# Altium project COMMS_ECU_revA.PrjPcb (part 1 of 3)
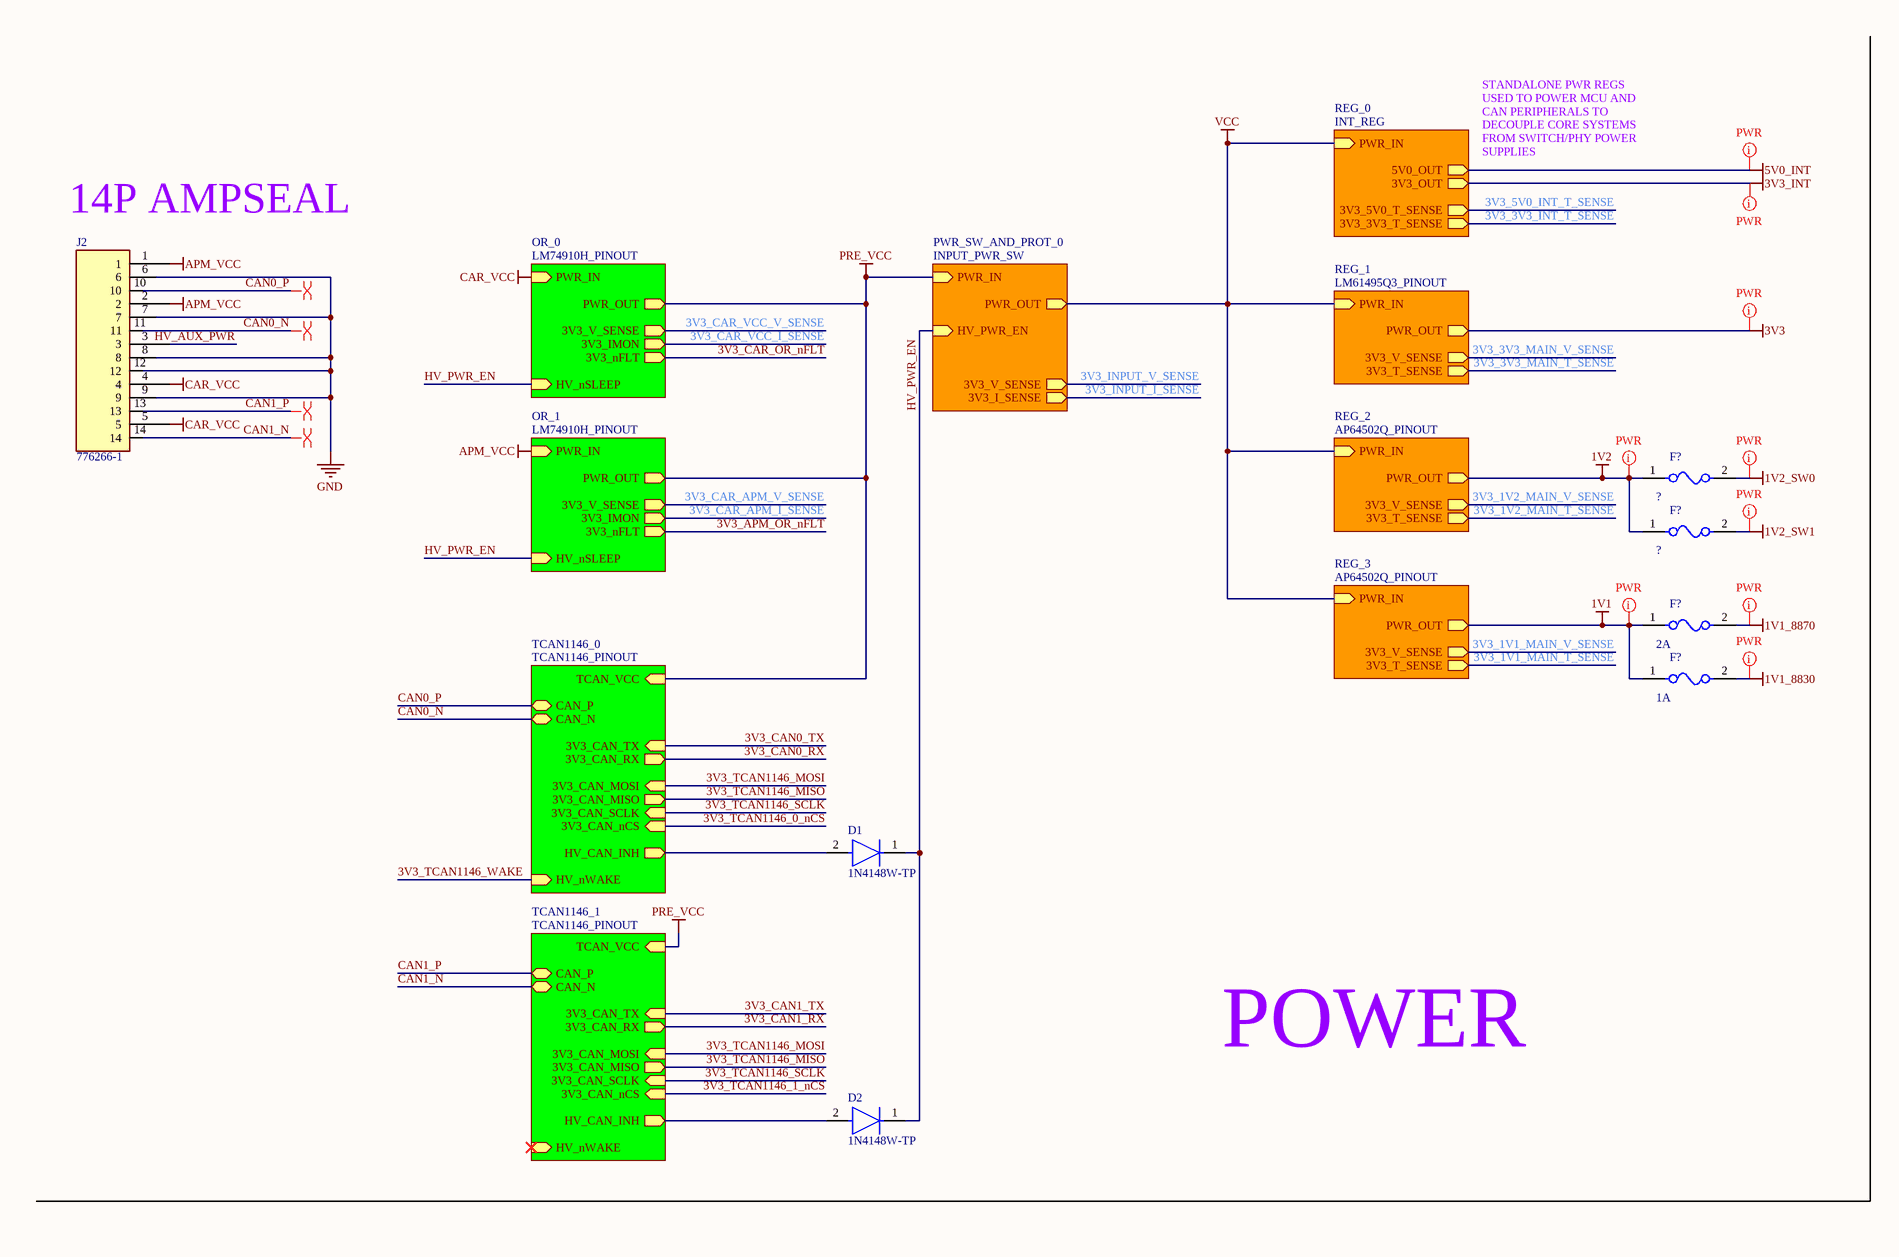
[diagram p0: COMMS_ECU_revA.SchDoc, top left]
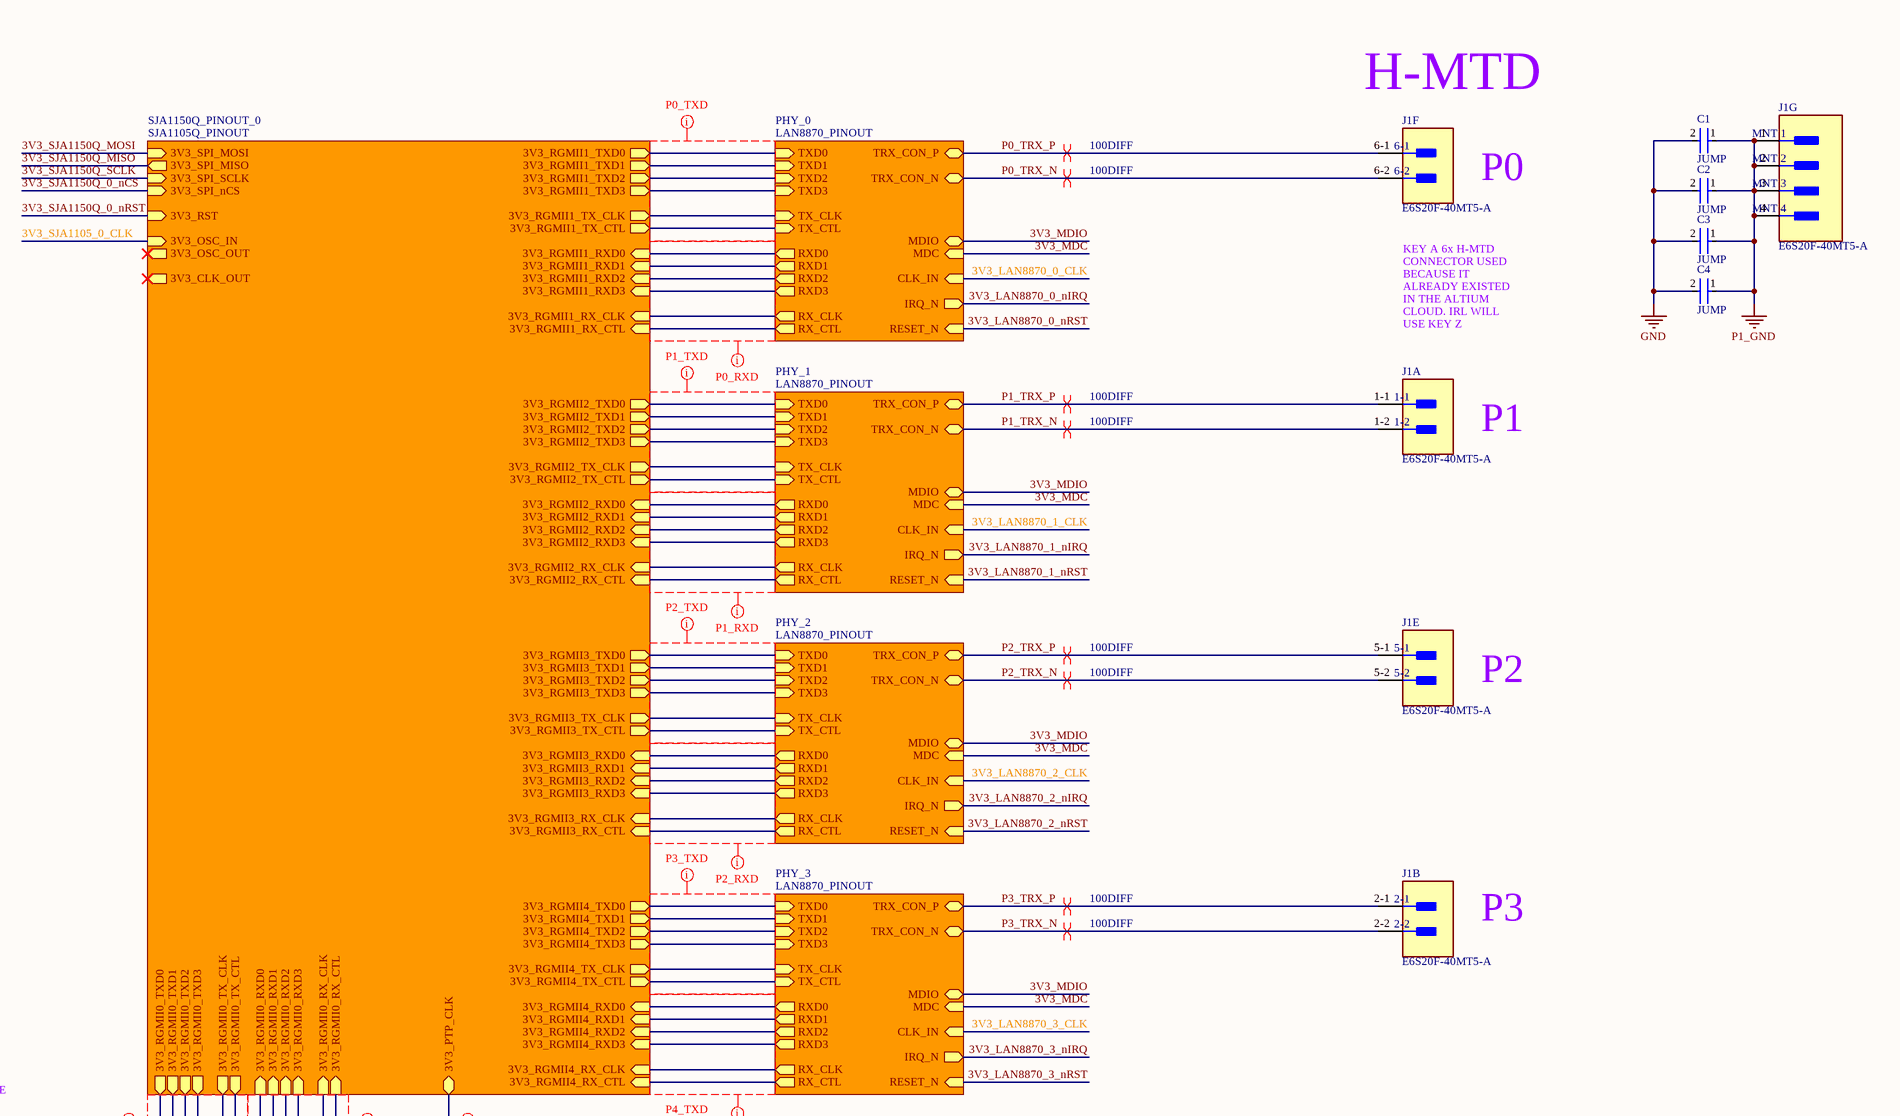
[diagram p1: COMMS_ECU_revA.SchDoc, top right]
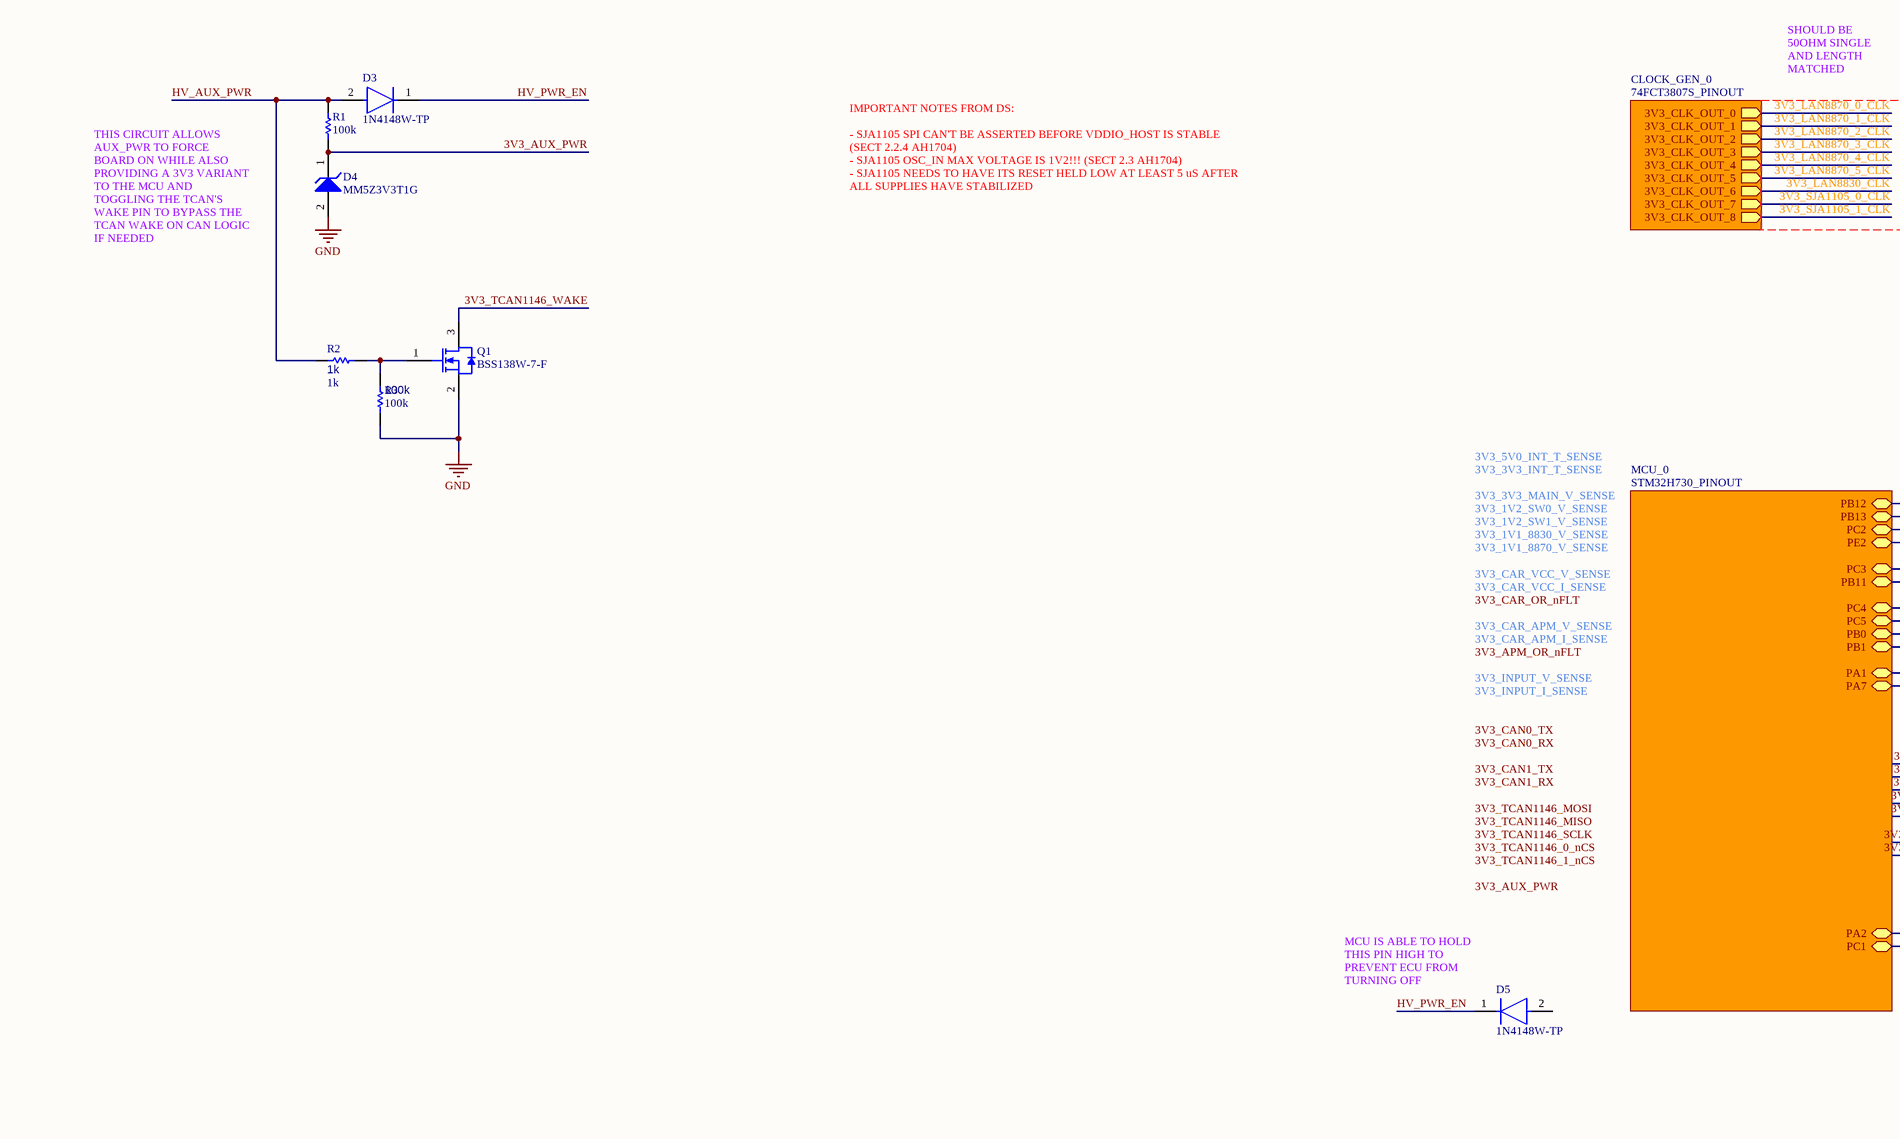
[diagram p2: COMMS_ECU_revA.SchDoc, bottom left]
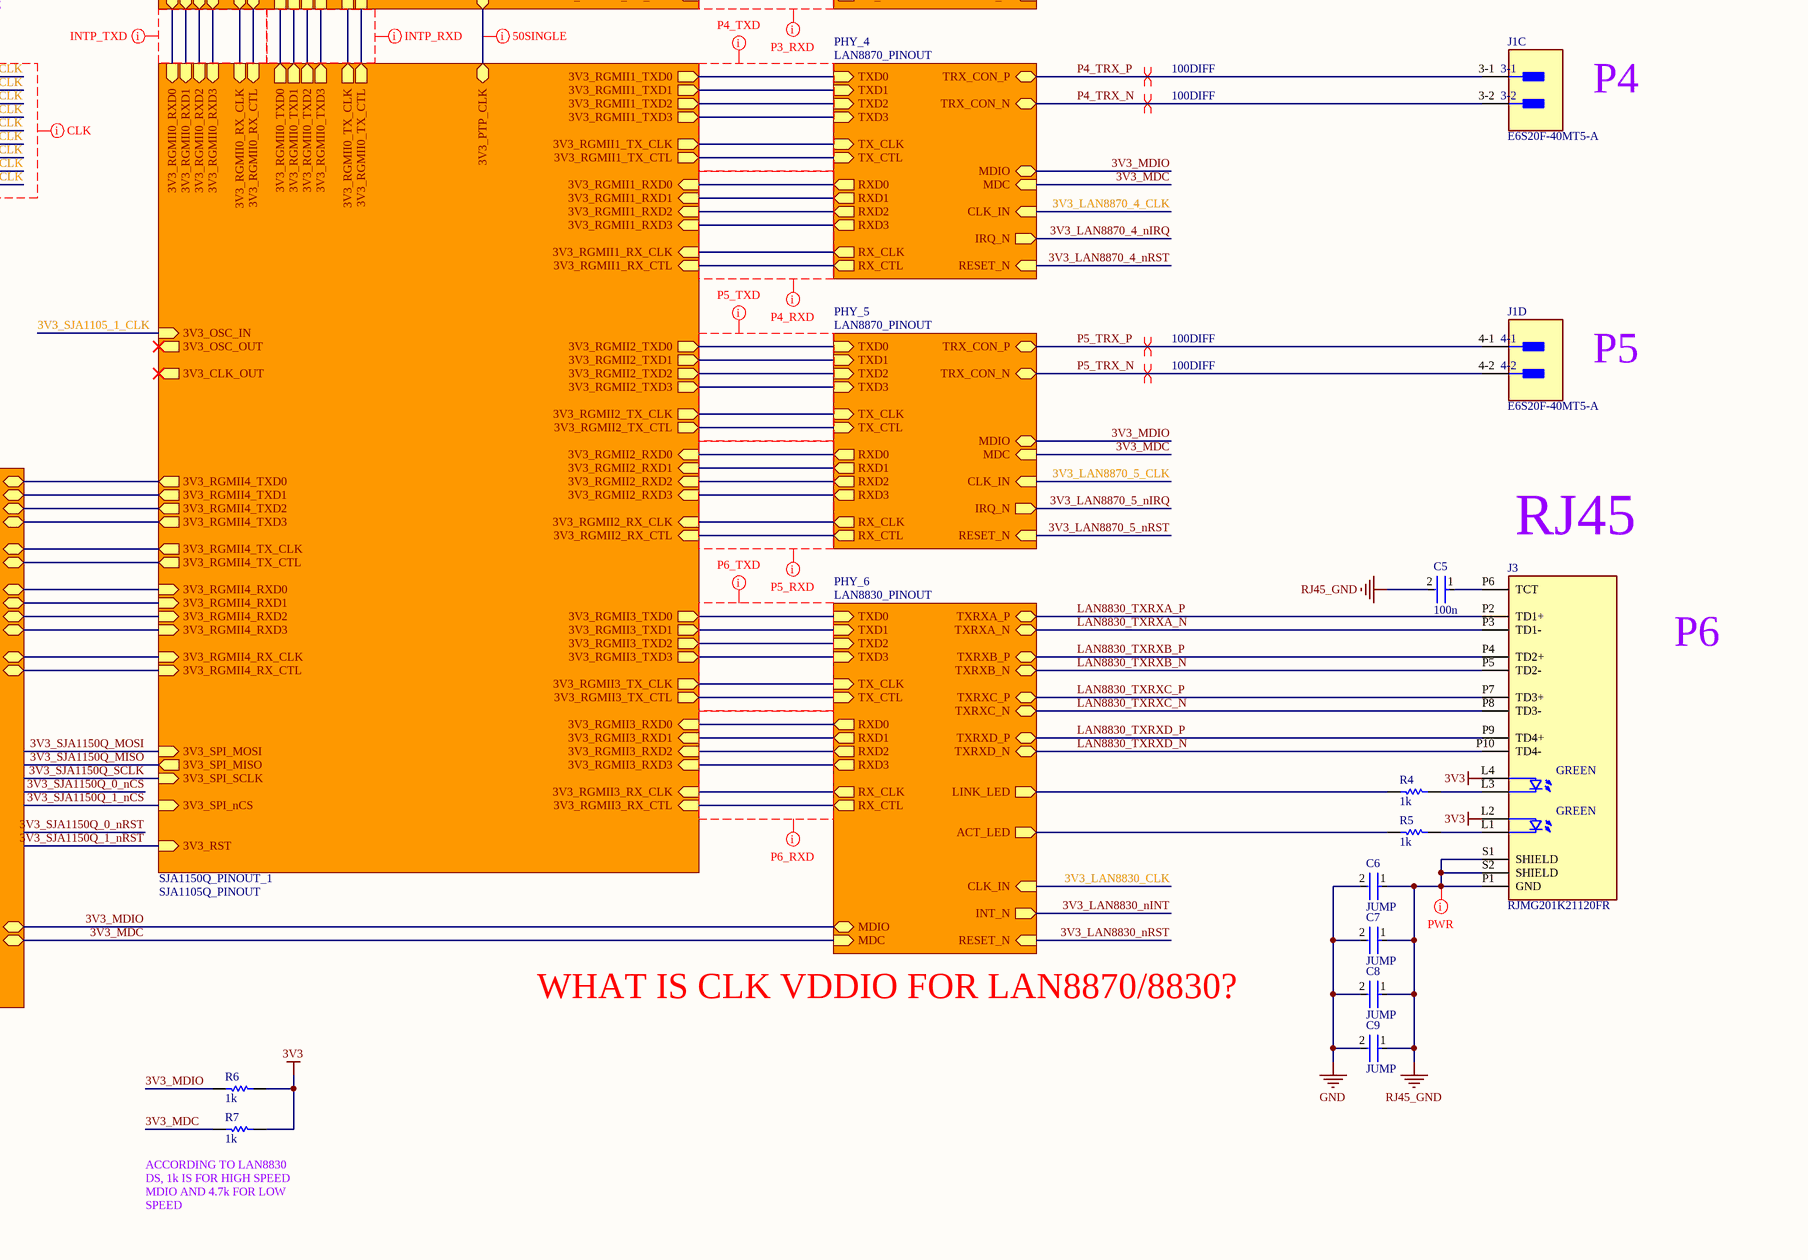
[diagram p3: COMMS_ECU_revA.SchDoc, bottom right]
13 sheets, 739 parts. Net scope: hierarchical (ports join the sheet entries above them; power ports are global).
Board file: COMMS_ECU_revA.PcbDoc
Sheets:
  COMMS_ECU_revA.SchDoc
    PHY_6 = LAN8830_PINOUT.SchDoc
    SJA1150Q_PINOUT_0 = SJA1105Q_PINOUT.SchDoc
    SJA1150Q_PINOUT_1 = SJA1105Q_PINOUT.SchDoc
    PHY_0 = LAN8870_PINOUT.SchDoc
    PHY_5 = LAN8870_PINOUT.SchDoc
    PHY_1 = LAN8870_PINOUT.SchDoc
    PHY_2 = LAN8870_PINOUT.SchDoc
    PHY_3 = LAN8870_PINOUT.SchDoc
    PHY_4 = LAN8870_PINOUT.SchDoc
    CLOCK_GEN_0 = 74FCT3807S_PINOUT.SchDoc
    MCU_0 = STM32H730_PINOUT.SchDoc
    TCAN1146_0 = TCAN1146_PINOUT.SchDoc
    OR_0 = LM74910H_PINOUT.SchDoc
    OR_1 = LM74910H_PINOUT.SchDoc
    PWR_SW_AND_PROT_0 = INPUT_PWR_SW.SchDoc
    REG_1 = LM61495Q3_PINOUT.SchDoc
    TCAN1146_1 = TCAN1146_PINOUT.SchDoc
    REG_3 = AP64502Q_PINOUT.SchDoc
    REG_0 = INT_REG.SchDoc
    REG_2 = AP64502Q_PINOUT.SchDoc
  MCP1726_PINOUT.SchDoc

## Sheet COMMS_ECU_revA.SchDoc
size D; SheetNumber: 1; SheetTotal: 13

### Parts
(Parts that share a designator on the sheet are numbered #1, #2 ... from top to bottom, then left to right.)
C1  JUMP  [FP-0402-L_1_0_0_05-W_0_5-IPC_A]
C2  JUMP  [FP-0402-L_1_0_0_05-W_0_5-IPC_A]
C3  JUMP  [FP-0402-L_1_0_0_05-W_0_5-IPC_A]
C4  JUMP  [FP-0402-L_1_0_0_05-W_0_5-IPC_A]
C5  100n  [FP-0402-L_1_0_0_05-W_0_5-IPC_A]
C6  JUMP  [FP-0402-L_1_0_0_05-W_0_5-IPC_A]
C7  JUMP  [FP-0402-L_1_0_0_05-W_0_5-IPC_A]
C8  JUMP  [FP-0402-L_1_0_0_05-W_0_5-IPC_A]
C9  JUMP  [FP-0402-L_1_0_0_05-W_0_5-IPC_A]
D1  1N4148W-TP  [FP-SOD-123-IPC_A]
D2  1N4148W-TP  [FP-SOD-123-IPC_A]
D3  1N4148W-TP  [FP-SOD-123-IPC_A]
D4  MM5Z3V3T1G  [ONSC-SOD-523-2-502-01_V]
D5  1N4148W-TP  [FP-SOD-123-IPC_A]
F?#1  ?  [FP-SF-1206FP-MFG]
F?#2  ?  [FP-SF-1206FP-MFG]
F?#3  2A  [FP-SF-1206FP-MFG]
F?#4  1A  [FP-SF-1206FP-MFG]
J1  E6S20F-40MT5-A  [FP-E6S20F-40MT5-A-MFG]  (parts A,B,C,D,E,F,G of 7)
J2  776266-1  [776266-1-Footprint-1]
J3  RJMG201K21120FR  [RJMG201K21120FR-Footprint-1]
Q1  BSS138W-7-F  [DIOD-SOT323-3_V]
R1  100k  [R0603B]
R2  1k  [R0603B]
R3  100k  [R0603B]
R4  1k  [R0603B]
R5  1k  [R0603B]
R6  1k  [R0603B]
R7  1k  [R0603B]

### Sub-sheets
CLOCK_GEN_0 = 74FCT3807S_PINOUT: 3V3_CLK_OUT_0 (out), 3V3_CLK_OUT_1 (out), 3V3_CLK_OUT_2 (out), 3V3_CLK_OUT_3 (out), 3V3_CLK_OUT_4 (out), 3V3_CLK_OUT_5 (out), 3V3_CLK_OUT_6 (out), 3V3_CLK_OUT_7 (out), 3V3_CLK_OUT_8 (out)
MCU_0 = STM32H730_PINOUT: PA1 (bidir), PA7 (bidir), PB0 (bidir), PB1 (bidir), PC4 (bidir), PB11 (bidir), PB12 (bidir), PB13 (bidir), PC2 (bidir), PC3 (bidir), PE2 (bidir), PC5 (bidir), PA2 (bidir), PC1 (bidir)
OR_0 = LM74910H_PINOUT: PWR_IN (in), PWR_OUT (out), 3V3_nFLT (out), HV_nSLEEP (in), 3V3_IMON (out), 3V3_V_SENSE (out)
OR_1 = LM74910H_PINOUT: PWR_IN (in), PWR_OUT (out), 3V3_nFLT (out), HV_nSLEEP (in), 3V3_IMON (out), 3V3_V_SENSE (out)
PHY_0 = LAN8870_PINOUT: TRX_CON_P (bidir), TRX_CON_N (bidir), RESET_N (in), TXD0 (in), TXD1 (in), TXD2 (in), TXD3 (in), TX_CTL (in), RXD0 (out), RXD1 (out), RXD2 (out), RXD3 (out), RX_CTL (out), TX_CLK (in), RX_CLK (out), MDIO (bidir), MDC (in), IRQ_N (out), CLK_IN (in)
PHY_1 = LAN8870_PINOUT: TRX_CON_P (bidir), TRX_CON_N (bidir), RESET_N (in), TXD0 (in), TXD1 (in), TXD2 (in), TXD3 (in), TX_CTL (in), RXD0 (out), RXD1 (out), RXD2 (out), RXD3 (out), RX_CTL (out), TX_CLK (in), RX_CLK (out), MDIO (bidir), MDC (in), IRQ_N (out), CLK_IN (in)
PHY_2 = LAN8870_PINOUT: TRX_CON_P (bidir), TRX_CON_N (bidir), RESET_N (in), TXD0 (in), TXD1 (in), TXD2 (in), TXD3 (in), TX_CTL (in), RXD0 (out), RXD1 (out), RXD2 (out), RXD3 (out), RX_CTL (out), TX_CLK (in), RX_CLK (out), MDIO (bidir), MDC (in), IRQ_N (out), CLK_IN (in)
PHY_3 = LAN8870_PINOUT: TRX_CON_P (bidir), TRX_CON_N (bidir), RESET_N (in), TXD0 (in), TXD1 (in), TXD2 (in), TXD3 (in), TX_CTL (in), RXD0 (out), RXD1 (out), RXD2 (out), RXD3 (out), RX_CTL (out), TX_CLK (in), RX_CLK (out), MDIO (bidir), MDC (in), IRQ_N (out), CLK_IN (in)
PHY_4 = LAN8870_PINOUT: TRX_CON_P (bidir), TRX_CON_N (bidir), RESET_N (in), TXD0 (in), TXD1 (in), TXD2 (in), TXD3 (in), TX_CTL (in), RXD0 (out), RXD1 (out), RXD2 (out), RXD3 (out), RX_CTL (out), TX_CLK (in), RX_CLK (out), MDIO (bidir), MDC (in), IRQ_N (out), CLK_IN (in)
PHY_5 = LAN8870_PINOUT: TRX_CON_P (bidir), TRX_CON_N (bidir), RESET_N (in), TXD0 (in), TXD1 (in), TXD2 (in), TXD3 (in), TX_CTL (in), RXD0 (out), RXD1 (out), RXD2 (out), RXD3 (out), RX_CTL (out), TX_CLK (in), RX_CLK (out), MDIO (bidir), MDC (in), IRQ_N (out), CLK_IN (in)
PHY_6 = LAN8830_PINOUT: TXD0 (in), TXD1 (in), TXD2 (in), TXD3 (in), TX_CTL (in), RXD0 (out), RXD1 (out), RXD2 (out), RXD3 (out), RX_CTL (out), TXRXA_P (bidir), TXRXA_N (bidir), ACT_LED (out), LINK_LED (out), RESET_N (in), TXRXB_P (bidir), TXRXB_N (bidir), TXRXC_P (bidir), TXRXC_N (bidir), TXRXD_P (bidir), TXRXD_N (bidir), TX_CLK (in), RX_CLK (out), MDIO (bidir), MDC (in), INT_N (out), CLK_IN (in)
PWR_SW_AND_PROT_0 = INPUT_PWR_SW: PWR_IN (in), PWR_OUT (out), HV_PWR_EN (in), 3V3_I_SENSE (out), 3V3_V_SENSE (out)
REG_0 = INT_REG: PWR_IN (in), 5V0_OUT (out), 3V3_OUT (out), 3V3_5V0_T_SENSE (out), 3V3_3V3_T_SENSE (out)
REG_1 = LM61495Q3_PINOUT: PWR_IN (in), PWR_OUT (out), 3V3_V_SENSE (out), 3V3_T_SENSE (out)
REG_2 = AP64502Q_PINOUT: PWR_OUT (out), PWR_IN (in), 3V3_V_SENSE (out), 3V3_T_SENSE (out)
REG_3 = AP64502Q_PINOUT: PWR_OUT (out), PWR_IN (in), 3V3_V_SENSE (out), 3V3_T_SENSE (out)
SJA1150Q_PINOUT_0 = SJA1105Q_PINOUT: 3V3_RGMII1_TXD0 (out), 3V3_RGMII1_TXD1 (out), 3V3_RGMII1_TXD2 (out), 3V3_RGMII1_TXD3 (out), 3V3_RGMII1_TX_CLK (out), 3V3_RGMII1_TX_CTL (out), 3V3_RGMII1_RXD0 (in), 3V3_RGMII1_RXD1 (in), 3V3_RGMII1_RXD2 (in), 3V3_RGMII1_RXD3 (in), 3V3_RGMII1_RX_CLK (in), 3V3_RGMII1_RX_CTL (in), 3V3_RGMII2_TXD0 (out), 3V3_RGMII2_TXD1 (out), 3V3_RGMII2_TXD2 (out), 3V3_RGMII2_TXD3 (out), 3V3_RGMII2_TX_CLK (out), 3V3_RGMII2_TX_CTL (out), 3V3_RGMII2_RXD0 (in), 3V3_RGMII2_RXD1 (in), 3V3_RGMII2_RXD2 (in), 3V3_RGMII2_RXD3 (in), 3V3_RGMII2_RX_CLK (in), 3V3_RGMII2_RX_CTL (in), 3V3_RGMII3_TXD0 (out), 3V3_RGMII3_TXD1 (out), 3V3_RGMII3_TXD2 (out), 3V3_RGMII3_TXD3 (out), 3V3_RGMII3_TX_CLK (out), 3V3_RGMII3_TX_CTL (out), 3V3_RGMII3_RXD0 (in), 3V3_RGMII3_RXD1 (in), 3V3_RGMII3_RXD2 (in), 3V3_RGMII3_RXD3 (in), 3V3_RGMII3_RX_CLK (in), 3V3_RGMII3_RX_CTL (in), 3V3_RGMII4_TXD0 (out), 3V3_RGMII4_TXD1 (out), 3V3_RGMII4_TXD2 (out), 3V3_RGMII4_TXD3 (out), 3V3_RGMII4_TX_CLK (out), 3V3_RGMII4_TX_CTL (out), 3V3_RGMII4_RXD0 (in), 3V3_RGMII4_RXD1 (in), 3V3_RGMII4_RXD2 (in), 3V3_RGMII4_RXD3 (in), 3V3_RGMII4_RX_CLK (in), 3V3_RGMII4_RX_CTL (in), 3V3_CLK_OUT (out), 3V3_RGMII0_TXD0 (out), 3V3_RGMII0_TXD1 (out), 3V3_RGMII0_TXD2 (out), 3V3_RGMII0_TXD3 (out), 3V3_RGMII0_TX_CLK (out), 3V3_RGMII0_TX_CTL (out), 3V3_RGMII0_RXD0 (in), 3V3_RGMII0_RXD1 (in), 3V3_RGMII0_RXD2 (in), 3V3_RGMII0_RXD3 (in), 3V3_RGMII0_RX_CLK (in), 3V3_RGMII0_RX_CTL (in), 3V3_PTP_CLK (bidir), 3V3_RST (in), 3V3_SPI_MOSI (in), 3V3_SPI_MISO (out), 3V3_SPI_SCLK (in), 3V3_SPI_nCS (in), 3V3_OSC_OUT (out), 3V3_OSC_IN (in)
SJA1150Q_PINOUT_1 = SJA1105Q_PINOUT: 3V3_RGMII1_TXD0 (out), 3V3_RGMII1_TXD1 (out), 3V3_RGMII1_TXD2 (out), 3V3_RGMII1_TXD3 (out), 3V3_RGMII1_TX_CLK (out), 3V3_RGMII1_TX_CTL (out), 3V3_RGMII1_RXD0 (in), 3V3_RGMII1_RXD1 (in), 3V3_RGMII1_RXD2 (in), 3V3_RGMII1_RXD3 (in), 3V3_RGMII1_RX_CLK (in), 3V3_RGMII1_RX_CTL (in), 3V3_RGMII2_TXD0 (out), 3V3_RGMII2_TXD1 (out), 3V3_RGMII2_TXD2 (out), 3V3_RGMII2_TXD3 (out), 3V3_RGMII2_TX_CLK (out), 3V3_RGMII2_TX_CTL (out), 3V3_RGMII2_RXD0 (in), 3V3_RGMII2_RXD1 (in), 3V3_RGMII2_RXD2 (in), 3V3_RGMII2_RXD3 (in), 3V3_RGMII2_RX_CLK (in), 3V3_RGMII2_RX_CTL (in), 3V3_RGMII3_TXD0 (out), 3V3_RGMII3_TXD1 (out), 3V3_RGMII3_TXD2 (out), 3V3_RGMII3_TXD3 (out), 3V3_RGMII3_TX_CLK (out), 3V3_RGMII3_TX_CTL (out), 3V3_RGMII3_RXD0 (in), 3V3_RGMII3_RXD1 (in), 3V3_RGMII3_RXD2 (in), 3V3_RGMII3_RXD3 (in), 3V3_RGMII3_RX_CLK (in), 3V3_RGMII3_RX_CTL (in), 3V3_RGMII4_TXD0 (out), 3V3_RGMII4_TXD1 (out), 3V3_RGMII4_TXD2 (out), 3V3_RGMII4_TXD3 (out), 3V3_RGMII4_TX_CLK (out), 3V3_RGMII4_TX_CTL (out), 3V3_RGMII4_RXD0 (in), 3V3_RGMII4_RXD1 (in), 3V3_RGMII4_RXD2 (in), 3V3_RGMII4_RXD3 (in), 3V3_RGMII4_RX_CLK (in), 3V3_RGMII4_RX_CTL (in), 3V3_RST (in), 3V3_SPI_MOSI (in), 3V3_SPI_MISO (out), 3V3_SPI_SCLK (in), 3V3_SPI_nCS (in), 3V3_RGMII0_RXD0 (in), 3V3_RGMII0_RXD1 (in), 3V3_RGMII0_RXD2 (in), 3V3_RGMII0_RXD3 (in), 3V3_RGMII0_TXD0 (out), 3V3_RGMII0_TXD1 (out), 3V3_RGMII0_TXD2 (out), 3V3_RGMII0_TXD3 (out), 3V3_RGMII0_RX_CLK (in), 3V3_RGMII0_RX_CTL (in), 3V3_RGMII0_TX_CLK (out), 3V3_RGMII0_TX_CTL (out), 3V3_CLK_OUT (out), 3V3_PTP_CLK (bidir), 3V3_OSC_OUT (out), 3V3_OSC_IN (in)
TCAN1146_0 = TCAN1146_PINOUT: CAN_P (bidir), CAN_N (bidir), HV_CAN_INH (out), TCAN_VCC (in), 3V3_CAN_TX (in), 3V3_CAN_RX (out), 3V3_CAN_MOSI (in), 3V3_CAN_MISO (out), 3V3_CAN_SCLK (in), 3V3_CAN_nCS (in), HV_nWAKE (in)
TCAN1146_1 = TCAN1146_PINOUT: CAN_P (bidir), CAN_N (bidir), HV_CAN_INH (out), TCAN_VCC (in), 3V3_CAN_TX (in), 3V3_CAN_RX (out), 3V3_CAN_MOSI (in), 3V3_CAN_MISO (out), 3V3_CAN_SCLK (in), 3V3_CAN_nCS (in), HV_nWAKE (in)

### Nets
1V1: F?#3.1 F?#4.1 ; sheet REG_3/PWR_OUT
1V1_8830: F?#4.2
1V1_8870: F?#3.2
1V2: F?#1.1 F?#2.1 ; sheet REG_2/PWR_OUT
1V2_SW0: F?#1.2
1V2_SW1: F?#2.2
3V3: J3.L2 J3.L4 R6.2 R7.2 ; sheet REG_1/PWR_OUT
APM_VCC: J2.1 J2.2 ; sheet OR_1/PWR_IN
CAR_VCC: J2.4 J2.5 ; sheet OR_0/PWR_IN
GND: C1.2 C2.2 C3.2 C4.2 C6.2 C7.2 C8.2 C9.2 D4.2(A) J2.6 J2.7 J2.8 J2.9 J2.12 Q1.2(S) R3.1
P1_GND: C1.1 C2.1 C3.1 C4.1 J1.1(MNT_1) J1.2(MNT_2) J1.3(MNT_3) J1.4(MNT_4)
PRE_VCC: sheet TCAN1146_0/TCAN_VCC, sheet OR_0/PWR_OUT, sheet OR_1/PWR_OUT, sheet PWR_SW_AND_PROT_0/PWR_IN, sheet TCAN1146_1/TCAN_VCC
RJ45_GND: C5.2 C6.1 C7.1 C8.1 C9.1 J3.P1(GND) J3.S1(SHIELD) J3.S2(SHIELD)
VCC: sheet PWR_SW_AND_PROT_0/PWR_OUT, sheet REG_1/PWR_IN, sheet REG_3/PWR_IN, sheet REG_0/PWR_IN, sheet REG_2/PWR_IN
3V3_1V1_MAIN_T_SENSE: sheet REG_3/3V3_T_SENSE
3V3_1V2_MAIN_T_SENSE: sheet REG_2/3V3_T_SENSE
3V3_3V3_INT_T_SENSE: sheet REG_0/3V3_3V3_T_SENSE
3V3_3V3_MAIN_T_SENSE: sheet REG_1/3V3_T_SENSE
3V3_5V0_INT_T_SENSE: sheet REG_0/3V3_5V0_T_SENSE
3V3_AUX_PWR: D4.1(K) R1.1
3V3_LAN8830_CLK: sheet PHY_6/CLK_IN, sheet CLOCK_GEN_0/3V3_CLK_OUT_6
3V3_LAN8870_0_CLK: sheet PHY_0/CLK_IN, sheet CLOCK_GEN_0/3V3_CLK_OUT_0
3V3_LAN8870_1_CLK: sheet PHY_1/CLK_IN, sheet CLOCK_GEN_0/3V3_CLK_OUT_1
3V3_LAN8870_2_CLK: sheet PHY_2/CLK_IN, sheet CLOCK_GEN_0/3V3_CLK_OUT_2
3V3_LAN8870_3_CLK: sheet PHY_3/CLK_IN, sheet CLOCK_GEN_0/3V3_CLK_OUT_3
3V3_LAN8870_4_CLK: sheet PHY_4/CLK_IN, sheet CLOCK_GEN_0/3V3_CLK_OUT_4
3V3_LAN8870_5_CLK: sheet PHY_5/CLK_IN, sheet CLOCK_GEN_0/3V3_CLK_OUT_5
3V3_MDC: R7.1 ; sheet PHY_6/MDC, sheet PHY_0/MDC, sheet PHY_5/MDC, sheet PHY_1/MDC, sheet PHY_2/MDC, sheet PHY_3/MDC, sheet PHY_4/MDC, sheet MCU_0/PC1
3V3_MDIO: R6.1 ; sheet PHY_6/MDIO, sheet PHY_0/MDIO, sheet PHY_5/MDIO, sheet PHY_1/MDIO, sheet PHY_2/MDIO, sheet PHY_3/MDIO, sheet PHY_4/MDIO, sheet MCU_0/PA2
3V3_SJA1105_0_CLK: sheet SJA1150Q_PINOUT_0/3V3_OSC_IN, sheet CLOCK_GEN_0/3V3_CLK_OUT_7
3V3_SJA1105_1_CLK: sheet SJA1150Q_PINOUT_1/3V3_OSC_IN, sheet CLOCK_GEN_0/3V3_CLK_OUT_8
3V3_SJA1150Q_MISO: sheet SJA1150Q_PINOUT_0/3V3_SPI_MISO, sheet SJA1150Q_PINOUT_1/3V3_SPI_MISO
3V3_SJA1150Q_MOSI: sheet SJA1150Q_PINOUT_0/3V3_SPI_MOSI, sheet SJA1150Q_PINOUT_1/3V3_SPI_MOSI
3V3_SJA1150Q_SCLK: sheet SJA1150Q_PINOUT_0/3V3_SPI_SCLK, sheet SJA1150Q_PINOUT_1/3V3_SPI_SCLK
3V3_TCAN1146_MISO: sheet TCAN1146_0/3V3_CAN_MISO, sheet TCAN1146_1/3V3_CAN_MISO
3V3_TCAN1146_MOSI: sheet TCAN1146_0/3V3_CAN_MOSI, sheet TCAN1146_1/3V3_CAN_MOSI
3V3_TCAN1146_SCLK: sheet TCAN1146_0/3V3_CAN_SCLK, sheet TCAN1146_1/3V3_CAN_SCLK
3V3_TCAN1146_WAKE: Q1.3(D) ; sheet TCAN1146_0/HV_nWAKE
CAN0_N: J2.11 ; sheet TCAN1146_0/CAN_N
CAN0_P: J2.10 ; sheet TCAN1146_0/CAN_P
CAN1_N: J2.14 ; sheet TCAN1146_1/CAN_N
CAN1_P: J2.13 ; sheet TCAN1146_1/CAN_P
HV_AUX_PWR: D3.2(A) J2.3 R1.2 R2.1
HV_PWR_EN: D1.1(C) D2.1(C) D3.1(C) D5.1(C) ; sheet OR_0/HV_nSLEEP, sheet OR_1/HV_nSLEEP, sheet PWR_SW_AND_PROT_0/HV_PWR_EN
LAN8830_CLK125_EN: sheet PHY_6/RX_CTL, sheet SJA1150Q_PINOUT_1/3V3_RGMII3_RX_CTL
LAN8830_MODE0: sheet PHY_6/RXD0, sheet SJA1150Q_PINOUT_1/3V3_RGMII3_RXD0
LAN8830_MODE1: sheet PHY_6/RXD1, sheet SJA1150Q_PINOUT_1/3V3_RGMII3_RXD1
LAN8830_MODE2: sheet PHY_6/RXD2, sheet SJA1150Q_PINOUT_1/3V3_RGMII3_RXD2
LAN8830_MODE3: sheet PHY_6/RXD3, sheet SJA1150Q_PINOUT_1/3V3_RGMII3_RXD3
LAN8830_MODE4: sheet PHY_6/RX_CLK, sheet SJA1150Q_PINOUT_1/3V3_RGMII3_RX_CLK
LAN8830_PHYAD0: R5.1 ; sheet PHY_6/ACT_LED
LAN8830_PHYAD1: R4.1 ; sheet PHY_6/LINK_LED
LAN8830_TXRXA_N: J3.P3(TD1-) ; sheet PHY_6/TXRXA_N
LAN8830_TXRXA_P: J3.P2(TD1+) ; sheet PHY_6/TXRXA_P
LAN8830_TXRXB_N: J3.P5(TD2-) ; sheet PHY_6/TXRXB_N
LAN8830_TXRXB_P: J3.P4(TD2+) ; sheet PHY_6/TXRXB_P
LAN8830_TXRXC_N: J3.P8(TD3-) ; sheet PHY_6/TXRXC_N
LAN8830_TXRXC_P: J3.P7(TD3+) ; sheet PHY_6/TXRXC_P
LAN8830_TXRXD_N: J3.P10(TD4-) ; sheet PHY_6/TXRXD_N
LAN8830_TXRXD_P: J3.P9(TD4+) ; sheet PHY_6/TXRXD_P
LAN8870_RX_CLK: sheet SJA1150Q_PINOUT_0/3V3_RGMII1_RX_CLK, sheet PHY_0/RX_CLK
LAN8870_RX_CLK: sheet SJA1150Q_PINOUT_0/3V3_RGMII2_RX_CLK, sheet PHY_1/RX_CLK  [a separate net that carries the same name]
LAN8870_RX_CLK: sheet SJA1150Q_PINOUT_0/3V3_RGMII3_RX_CLK, sheet PHY_2/RX_CLK  [a separate net that carries the same name]
LAN8870_RX_CLK: sheet SJA1150Q_PINOUT_0/3V3_RGMII4_RX_CLK, sheet PHY_3/RX_CLK  [a separate net that carries the same name]
LAN8870_RX_CLK: sheet SJA1150Q_PINOUT_1/3V3_RGMII1_RX_CLK, sheet PHY_4/RX_CLK  [a separate net that carries the same name]
LAN8870_RX_CLK: sheet SJA1150Q_PINOUT_1/3V3_RGMII2_RX_CLK, sheet PHY_5/RX_CLK  [a separate net that carries the same name]
LAN8870_RXCTL: sheet SJA1150Q_PINOUT_0/3V3_RGMII1_RX_CTL, sheet PHY_0/RX_CTL
LAN8870_RXCTL: sheet SJA1150Q_PINOUT_0/3V3_RGMII2_RX_CTL, sheet PHY_1/RX_CTL  [a separate net that carries the same name]
LAN8870_RXCTL: sheet SJA1150Q_PINOUT_0/3V3_RGMII3_RX_CTL, sheet PHY_2/RX_CTL  [a separate net that carries the same name]
LAN8870_RXCTL: sheet SJA1150Q_PINOUT_0/3V3_RGMII4_RX_CTL, sheet PHY_3/RX_CTL  [a separate net that carries the same name]
LAN8870_RXCTL: sheet SJA1150Q_PINOUT_1/3V3_RGMII1_RX_CTL, sheet PHY_4/RX_CTL  [a separate net that carries the same name]
LAN8870_RXCTL: sheet SJA1150Q_PINOUT_1/3V3_RGMII2_RX_CTL, sheet PHY_5/RX_CTL  [a separate net that carries the same name]
LAN8870_RXD0: sheet SJA1150Q_PINOUT_0/3V3_RGMII1_RXD0, sheet PHY_0/RXD0
LAN8870_RXD0: sheet SJA1150Q_PINOUT_0/3V3_RGMII2_RXD0, sheet PHY_1/RXD0  [a separate net that carries the same name]
LAN8870_RXD0: sheet SJA1150Q_PINOUT_0/3V3_RGMII3_RXD0, sheet PHY_2/RXD0  [a separate net that carries the same name]
LAN8870_RXD0: sheet SJA1150Q_PINOUT_0/3V3_RGMII4_RXD0, sheet PHY_3/RXD0  [a separate net that carries the same name]
LAN8870_RXD0: sheet SJA1150Q_PINOUT_1/3V3_RGMII1_RXD0, sheet PHY_4/RXD0  [a separate net that carries the same name]
LAN8870_RXD0: sheet SJA1150Q_PINOUT_1/3V3_RGMII2_RXD0, sheet PHY_5/RXD0  [a separate net that carries the same name]
LAN8870_RXD1: sheet SJA1150Q_PINOUT_0/3V3_RGMII1_RXD1, sheet PHY_0/RXD1
LAN8870_RXD1: sheet SJA1150Q_PINOUT_0/3V3_RGMII2_RXD1, sheet PHY_1/RXD1  [a separate net that carries the same name]
LAN8870_RXD1: sheet SJA1150Q_PINOUT_0/3V3_RGMII3_RXD1, sheet PHY_2/RXD1  [a separate net that carries the same name]
LAN8870_RXD1: sheet SJA1150Q_PINOUT_0/3V3_RGMII4_RXD1, sheet PHY_3/RXD1  [a separate net that carries the same name]
LAN8870_RXD1: sheet SJA1150Q_PINOUT_1/3V3_RGMII1_RXD1, sheet PHY_4/RXD1  [a separate net that carries the same name]
LAN8870_RXD1: sheet SJA1150Q_PINOUT_1/3V3_RGMII2_RXD1, sheet PHY_5/RXD1  [a separate net that carries the same name]
LAN8870_RXD2: sheet SJA1150Q_PINOUT_0/3V3_RGMII1_RXD2, sheet PHY_0/RXD2
LAN8870_RXD2: sheet SJA1150Q_PINOUT_0/3V3_RGMII2_RXD2, sheet PHY_1/RXD2  [a separate net that carries the same name]
LAN8870_RXD2: sheet SJA1150Q_PINOUT_0/3V3_RGMII3_RXD2, sheet PHY_2/RXD2  [a separate net that carries the same name]
LAN8870_RXD2: sheet SJA1150Q_PINOUT_0/3V3_RGMII4_RXD2, sheet PHY_3/RXD2  [a separate net that carries the same name]
LAN8870_RXD2: sheet SJA1150Q_PINOUT_1/3V3_RGMII1_RXD2, sheet PHY_4/RXD2  [a separate net that carries the same name]
LAN8870_RXD2: sheet SJA1150Q_PINOUT_1/3V3_RGMII2_RXD2, sheet PHY_5/RXD2  [a separate net that carries the same name]
LAN8870_RXD3: sheet SJA1150Q_PINOUT_0/3V3_RGMII1_RXD3, sheet PHY_0/RXD3
LAN8870_RXD3: sheet SJA1150Q_PINOUT_0/3V3_RGMII2_RXD3, sheet PHY_1/RXD3  [a separate net that carries the same name]
LAN8870_RXD3: sheet SJA1150Q_PINOUT_0/3V3_RGMII3_RXD3, sheet PHY_2/RXD3  [a separate net that carries the same name]
LAN8870_RXD3: sheet SJA1150Q_PINOUT_0/3V3_RGMII4_RXD3, sheet PHY_3/RXD3  [a separate net that carries the same name]
LAN8870_RXD3: sheet SJA1150Q_PINOUT_1/3V3_RGMII1_RXD3, sheet PHY_4/RXD3  [a separate net that carries the same name]
LAN8870_RXD3: sheet SJA1150Q_PINOUT_1/3V3_RGMII2_RXD3, sheet PHY_5/RXD3  [a separate net that carries the same name]
LAN8870_TX_CLK: sheet SJA1150Q_PINOUT_0/3V3_RGMII1_TX_CLK, sheet PHY_0/TX_CLK
LAN8870_TX_CLK: sheet SJA1150Q_PINOUT_0/3V3_RGMII2_TX_CLK, sheet PHY_1/TX_CLK  [a separate net that carries the same name]
LAN8870_TX_CLK: sheet SJA1150Q_PINOUT_0/3V3_RGMII3_TX_CLK, sheet PHY_2/TX_CLK  [a separate net that carries the same name]
LAN8870_TX_CLK: sheet SJA1150Q_PINOUT_0/3V3_RGMII4_TX_CLK, sheet PHY_3/TX_CLK  [a separate net that carries the same name]
LAN8870_TX_CLK: sheet SJA1150Q_PINOUT_1/3V3_RGMII1_TX_CLK, sheet PHY_4/TX_CLK  [a separate net that carries the same name]
LAN8870_TX_CLK: sheet SJA1150Q_PINOUT_1/3V3_RGMII2_TX_CLK, sheet PHY_5/TX_CLK  [a separate net that carries the same name]
LAN8870_TX_CTL: sheet SJA1150Q_PINOUT_0/3V3_RGMII1_TX_CTL, sheet PHY_0/TX_CTL
LAN8870_TX_CTL: sheet SJA1150Q_PINOUT_0/3V3_RGMII2_TX_CTL, sheet PHY_1/TX_CTL  [a separate net that carries the same name]
LAN8870_TX_CTL: sheet SJA1150Q_PINOUT_0/3V3_RGMII3_TX_CTL, sheet PHY_2/TX_CTL  [a separate net that carries the same name]
LAN8870_TX_CTL: sheet SJA1150Q_PINOUT_0/3V3_RGMII4_TX_CTL, sheet PHY_3/TX_CTL  [a separate net that carries the same name]
LAN8870_TX_CTL: sheet SJA1150Q_PINOUT_1/3V3_RGMII1_TX_CTL, sheet PHY_4/TX_CTL  [a separate net that carries the same name]
LAN8870_TX_CTL: sheet SJA1150Q_PINOUT_1/3V3_RGMII2_TX_CTL, sheet PHY_5/TX_CTL  [a separate net that carries the same name]
LAN8870_TXD0: sheet SJA1150Q_PINOUT_0/3V3_RGMII1_TXD0, sheet PHY_0/TXD0
LAN8870_TXD0: sheet SJA1150Q_PINOUT_0/3V3_RGMII2_TXD0, sheet PHY_1/TXD0  [a separate net that carries the same name]
LAN8870_TXD0: sheet SJA1150Q_PINOUT_0/3V3_RGMII3_TXD0, sheet PHY_2/TXD0  [a separate net that carries the same name]
LAN8870_TXD0: sheet SJA1150Q_PINOUT_0/3V3_RGMII4_TXD0, sheet PHY_3/TXD0  [a separate net that carries the same name]
LAN8870_TXD0: sheet SJA1150Q_PINOUT_1/3V3_RGMII1_TXD0, sheet PHY_4/TXD0  [a separate net that carries the same name]
LAN8870_TXD0: sheet SJA1150Q_PINOUT_1/3V3_RGMII2_TXD0, sheet PHY_5/TXD0  [a separate net that carries the same name]
LAN8870_TXD1: sheet SJA1150Q_PINOUT_0/3V3_RGMII1_TXD1, sheet PHY_0/TXD1
LAN8870_TXD1: sheet SJA1150Q_PINOUT_0/3V3_RGMII2_TXD1, sheet PHY_1/TXD1  [a separate net that carries the same name]
LAN8870_TXD1: sheet SJA1150Q_PINOUT_0/3V3_RGMII3_TXD1, sheet PHY_2/TXD1  [a separate net that carries the same name]
LAN8870_TXD1: sheet SJA1150Q_PINOUT_0/3V3_RGMII4_TXD1, sheet PHY_3/TXD1  [a separate net that carries the same name]
LAN8870_TXD1: sheet SJA1150Q_PINOUT_1/3V3_RGMII1_TXD1, sheet PHY_4/TXD1  [a separate net that carries the same name]
LAN8870_TXD1: sheet SJA1150Q_PINOUT_1/3V3_RGMII2_TXD1, sheet PHY_5/TXD1  [a separate net that carries the same name]
LAN8870_TXD2: sheet SJA1150Q_PINOUT_0/3V3_RGMII1_TXD2, sheet PHY_0/TXD2
LAN8870_TXD2: sheet SJA1150Q_PINOUT_0/3V3_RGMII2_TXD2, sheet PHY_1/TXD2  [a separate net that carries the same name]
LAN8870_TXD2: sheet SJA1150Q_PINOUT_0/3V3_RGMII3_TXD2, sheet PHY_2/TXD2  [a separate net that carries the same name]
LAN8870_TXD2: sheet SJA1150Q_PINOUT_0/3V3_RGMII4_TXD2, sheet PHY_3/TXD2  [a separate net that carries the same name]
LAN8870_TXD2: sheet SJA1150Q_PINOUT_1/3V3_RGMII1_TXD2, sheet PHY_4/TXD2  [a separate net that carries the same name]
LAN8870_TXD2: sheet SJA1150Q_PINOUT_1/3V3_RGMII2_TXD2, sheet PHY_5/TXD2  [a separate net that carries the same name]
LAN8870_TXD3: sheet SJA1150Q_PINOUT_0/3V3_RGMII1_TXD3, sheet PHY_0/TXD3
LAN8870_TXD3: sheet SJA1150Q_PINOUT_0/3V3_RGMII2_TXD3, sheet PHY_1/TXD3  [a separate net that carries the same name]
LAN8870_TXD3: sheet SJA1150Q_PINOUT_0/3V3_RGMII3_TXD3, sheet PHY_2/TXD3  [a separate net that carries the same name]
LAN8870_TXD3: sheet SJA1150Q_PINOUT_0/3V3_RGMII4_TXD3, sheet PHY_3/TXD3  [a separate net that carries the same name]
LAN8870_TXD3: sheet SJA1150Q_PINOUT_1/3V3_RGMII1_TXD3, sheet PHY_4/TXD3  [a separate net that carries the same name]
LAN8870_TXD3: sheet SJA1150Q_PINOUT_1/3V3_RGMII2_TXD3, sheet PHY_5/TXD3  [a separate net that carries the same name]
P0_TRX_N: J1.6-2 ; sheet PHY_0/TRX_CON_N
P0_TRX_P: J1.6-1 ; sheet PHY_0/TRX_CON_P
P1_TRX_N: J1.1-2 ; sheet PHY_1/TRX_CON_N
P1_TRX_P: J1.1-1 ; sheet PHY_1/TRX_CON_P
P2_TRX_N: J1.5-2 ; sheet PHY_2/TRX_CON_N
P2_TRX_P: J1.5-1 ; sheet PHY_2/TRX_CON_P
P3_TRX_N: J1.2-2 ; sheet PHY_3/TRX_CON_N
P3_TRX_P: J1.2-1 ; sheet PHY_3/TRX_CON_P
P4_TRX_N: J1.3-2 ; sheet PHY_4/TRX_CON_N
P4_TRX_P: J1.3-1 ; sheet PHY_4/TRX_CON_P
P5_TRX_N: J1.4-2 ; sheet PHY_5/TRX_CON_N
P5_TRX_P: J1.4-1 ; sheet PHY_5/TRX_CON_P
NetC5_1: C5.1 J3.P6(TCT)
NetD1_2: D1.2(A) ; sheet TCAN1146_0/HV_CAN_INH
NetD2_2: D2.2(A) ; sheet TCAN1146_1/HV_CAN_INH
NetJ3_L1: J3.L1 R5.2
NetJ3_L3: J3.L3 R4.2
NetQ1_1: Q1.1(G) R2.2 R3.2
NetU1_19: sheet PHY_6/TXD0, sheet SJA1150Q_PINOUT_1/3V3_RGMII3_TXD0
NetU1_20: sheet PHY_6/TXD1, sheet SJA1150Q_PINOUT_1/3V3_RGMII3_TXD1
NetU1_21: sheet PHY_6/TXD2, sheet SJA1150Q_PINOUT_1/3V3_RGMII3_TXD2
NetU1_22: sheet PHY_6/TXD3, sheet SJA1150Q_PINOUT_1/3V3_RGMII3_TXD3
NetU1_25: sheet PHY_6/TX_CLK, sheet SJA1150Q_PINOUT_1/3V3_RGMII3_TX_CLK
NetU1_26: sheet PHY_6/TX_CTL, sheet SJA1150Q_PINOUT_1/3V3_RGMII3_TX_CTL
NetU3_SJA1150Q_PINOUT_0_A2: sheet SJA1150Q_PINOUT_0/3V3_RGMII0_TXD0, sheet SJA1150Q_PINOUT_1/3V3_RGMII0_RXD0
NetU3_SJA1150Q_PINOUT_0_B1: sheet SJA1150Q_PINOUT_0/3V3_RGMII0_TXD1, sheet SJA1150Q_PINOUT_1/3V3_RGMII0_RXD1
NetU3_SJA1150Q_PINOUT_0_C1: sheet SJA1150Q_PINOUT_0/3V3_RGMII0_TXD3, sheet SJA1150Q_PINOUT_1/3V3_RGMII0_RXD3
NetU3_SJA1150Q_PINOUT_0_C2: sheet SJA1150Q_PINOUT_0/3V3_RGMII0_TXD2, sheet SJA1150Q_PINOUT_1/3V3_RGMII0_RXD2
NetU3_SJA1150Q_PINOUT_0_D1: sheet SJA1150Q_PINOUT_0/3V3_RGMII0_TX_CLK, sheet SJA1150Q_PINOUT_1/3V3_RGMII0_RX_CLK
NetU3_SJA1150Q_PINOUT_0_D2: sheet SJA1150Q_PINOUT_0/3V3_RGMII0_TX_CTL, sheet SJA1150Q_PINOUT_1/3V3_RGMII0_RX_CTL
NetU3_SJA1150Q_PINOUT_0_E1: sheet SJA1150Q_PINOUT_0/3V3_RGMII0_RXD0, sheet SJA1150Q_PINOUT_1/3V3_RGMII0_TXD0
NetU3_SJA1150Q_PINOUT_0_E2: sheet SJA1150Q_PINOUT_0/3V3_RGMII0_RX_CLK, sheet SJA1150Q_PINOUT_1/3V3_RGMII0_TX_CLK
NetU3_SJA1150Q_PINOUT_0_F1: sheet SJA1150Q_PINOUT_0/3V3_RGMII0_RXD2, sheet SJA1150Q_PINOUT_1/3V3_RGMII0_TXD2
NetU3_SJA1150Q_PINOUT_0_F2: sheet SJA1150Q_PINOUT_0/3V3_RGMII0_RXD1, sheet SJA1150Q_PINOUT_1/3V3_RGMII0_TXD1
NetU3_SJA1150Q_PINOUT_0_G1: sheet SJA1150Q_PINOUT_0/3V3_RGMII0_RX_CTL, sheet SJA1150Q_PINOUT_1/3V3_RGMII0_TX_CTL
NetU3_SJA1150Q_PINOUT_0_G2: sheet SJA1150Q_PINOUT_0/3V3_RGMII0_RXD3, sheet SJA1150Q_PINOUT_1/3V3_RGMII0_TXD3
NetU3_SJA1150Q_PINOUT_0_N4: sheet SJA1150Q_PINOUT_0/3V3_PTP_CLK, sheet SJA1150Q_PINOUT_1/3V3_PTP_CLK
NetU3_SJA1150Q_PINOUT_1_N7: sheet SJA1150Q_PINOUT_1/3V3_RGMII4_TXD1, sheet MCU_0/PB13
NetU3_SJA1150Q_PINOUT_1_N8: sheet SJA1150Q_PINOUT_1/3V3_RGMII4_TXD3, sheet MCU_0/PE2
NetU3_SJA1150Q_PINOUT_1_N9: sheet SJA1150Q_PINOUT_1/3V3_RGMII4_TX_CLK, sheet MCU_0/PC3
NetU3_SJA1150Q_PINOUT_1_N10: sheet SJA1150Q_PINOUT_1/3V3_RGMII4_RXD0, sheet MCU_0/PC4
NetU3_SJA1150Q_PINOUT_1_N11: sheet SJA1150Q_PINOUT_1/3V3_RGMII4_RXD2, sheet MCU_0/PB0
NetU3_SJA1150Q_PINOUT_1_N12: sheet SJA1150Q_PINOUT_1/3V3_RGMII4_RX_CTL, sheet MCU_0/PA7
NetU3_SJA1150Q_PINOUT_1_P7: sheet SJA1150Q_PINOUT_1/3V3_RGMII4_TXD0, sheet MCU_0/PB12
NetU3_SJA1150Q_PINOUT_1_P8: sheet SJA1150Q_PINOUT_1/3V3_RGMII4_TXD2, sheet MCU_0/PC2
NetU3_SJA1150Q_PINOUT_1_P9: sheet SJA1150Q_PINOUT_1/3V3_RGMII4_TX_CTL, sheet MCU_0/PB11
NetU3_SJA1150Q_PINOUT_1_P10: sheet SJA1150Q_PINOUT_1/3V3_RGMII4_RX_CLK, sheet MCU_0/PA1
NetU3_SJA1150Q_PINOUT_1_P11: sheet SJA1150Q_PINOUT_1/3V3_RGMII4_RXD1, sheet MCU_0/PC5
NetU3_SJA1150Q_PINOUT_1_P12: sheet SJA1150Q_PINOUT_1/3V3_RGMII4_RXD3, sheet MCU_0/PB1

Not connected (* = marked no-connect by the designer): D5 2(A)

### Layout directives
net class PWR: 1V1, 1V1_8830, 1V1_8870, 1V2, 1V2_SW0, 1V2_SW1, 3V3, 3V3_INT, 5V0_INT, RJ45_GND
net class P0_TXD; net class 50SINGLE: (no net found under the mark)
net class P0_RXD; net class 50SINGLE: (no net found under the mark)
differential pair; differential pair class 100DIFF: P0_TRX_N, P0_TRX_P, P1_TRX_N, P1_TRX_P, P2_TRX_N, P2_TRX_P, P3_TRX_N, P3_TRX_P, P4_TRX_N, P4_TRX_P, P5_TRX_N, P5_TRX_P
net class P1_TXD; net class 50SINGLE: (no net found under the mark)
net class P1_RXD; net class 50SINGLE: (no net found under the mark)
net class P2_TXD; net class 50SINGLE: (no net found under the mark)
net class P2_RXD; net class 50SINGLE: (no net found under the mark)
net class P3_TXD; net class 50SINGLE: (no net found under the mark)
net class P3_RXD; net class 50SINGLE: (no net found under the mark)
net class P4_TXD; net class 50SINGLE: (no net found under the mark)
net class P4_RXD; net class 50SINGLE: (no net found under the mark)
net class INTP_RXD; net class 50SINGLE: (no net found under the mark)
net class INTP_TXD; net class 50SINGLE: (no net found under the mark)
net class 50SINGLE: NetU3_SJA1150Q_PINOUT_0_N4
net class CLK; net class 50SINGLE: 3V3_LAN8830_CLK, 3V3_LAN8870_0_CLK, 3V3_LAN8870_1_CLK, 3V3_LAN8870_2_CLK, 3V3_LAN8870_3_CLK, 3V3_LAN8870_4_CLK, 3V3_LAN8870_5_CLK, 3V3_SJA1105_0_CLK, 3V3_SJA1105_1_CLK
differential pair: CAN0_N, CAN0_P, CAN1_N, CAN1_P

### Notes on the sheet
- STANDALONE PWR REGS USED TO POWER MCU AND CAN PERIPHERALS TO DECOUPLE CORE SYSTEMS FROM SWITCH/PHY POWER SUPPLIES
- (near J2) 14P AMPSEAL
- H-MTD
- P0
- KEY A 6x H-MTD CONNECTOR USED BECAUSE IT ALREADY EXISTED IN THE ALTIUM CLOUD. IRL WILL USE KEY Z
- P1
- P2
- POWER
- P3
- SHOULD BE 50OHM SINGLE AND LENGTH MATCHED
- P4
- THIS CIRCUIT ALLOWS AUX_PWR TO FORCE BOARD ON WHILE ALSO PROVIDING A 3V3 VARIANT TO THE MCU AND TOGGLING THE TCAN'S WAKE PIN TO BYPASS THE TCAN WAKE ON CAN LOGIC IF NEEDED
- P5
- IMPORTANT NOTES FROM DS:
  - SJA1105 SPI CAN'T BE ASSERTED BEFORE VDDIO_HOST IS STABLE (SECT 2.2.4 AH1704)
  - SJA1105 OSC_IN MAX VOLTAGE IS 1V2!!! (SECT 2.3 AH1704)
  - SJA1105 NEEDS TO HAVE ITS RESET HELD LOW AT LEAST 5 uS AFTER ALL SUPPLIES HAVE STABILIZED
- (near J3) RJ45
- P6
- (near D5) MCU IS ABLE TO HOLD THIS PIN HIGH TO PREVENT ECU FROM TURNING OFF
- WHAT IS CLK VDDIO FOR LAN8870/8830?
- (near R7) ACCORDING TO LAN8830 DS, 1k IS FOR HIGH SPEED MDIO AND 4.7k FOR LOW SPEED
- Labels drawn without touching a wire or pin: 3V3_1V1_8830_V_SENSE, 3V3_1V1_8870_V_SENSE, 3V3_1V2_SW0_V_SENSE, 3V3_1V2_SW1_V_SENSE, 3V3_3V3_INT_T_SENSE, 3V3_3V3_MAIN_V_SENSE, 3V3_5V0_INT_T_SENSE, 3V3_APM_OR_nFLT, 3V3_AUX_PWR, 3V3_CAN0_RX, 3V3_CAN0_TX, 3V3_CAN1_RX, 3V3_CAN1_TX, 3V3_CAR_APM_I_SENSE, 3V3_CAR_APM_V_SENSE, 3V3_CAR_OR_nFLT, 3V3_CAR_VCC_I_SENSE, 3V3_CAR_VCC_V_SENSE, 3V3_INPUT_I_SENSE, 3V3_INPUT_V_SENSE, 3V3_TCAN1146_0_nCS, 3V3_TCAN1146_1_nCS, 3V3_TCAN1146_MISO, 3V3_TCAN1146_MOSI, 3V3_TCAN1146_SCLK
- (in symbol CMP-002-00090-1) GREEN

### Library data of the parts
C1-C9 = CMP-001-00058-1: LARGE PADS, 0402 CAP, CHANGE COMMENT TO MATCH REAL P/N; Capacitor Type: Ceramic; Min Operating Temperature: -55°C; Mounting Technology: Surface Mount; Pins: 2; Case/Package: 0402; RoHS Compliant: Yes; Max Operating Temperature: 85°C
D1-D3 D5 = CMP-2000-04993-2: DIODE GEN PURP 100V 150MA SOD123; Max Reverse Leakage Current: 5uA; Max Surge Current: 2A; Reverse Recovery Time: 4ns; Polarity: Standard; Capacitance: 4pF; Max Forward Surge Current (Ifsm): 1A; Element Configuration: Single; Power Dissipation: 400mW; Forward Voltage: 1V; Radiation Hardening: No; Lead Free: Lead Free; Max Reverse Voltage (DC): 100V; Current Rating: 150mA; Forward Current: 150mA; Packaging: Tape and Reel; Number of Pins: 2; Package Quantity: 3000; Max Operating Temperature: 150°C; Min Operating Temperature: -65°C; Average Rectified Current: 150mA; Recovery Time: 4ns; Output Current: 150mA; Peak Non-Repetitive Surge Current: 2A; Width: 1.8mm; Voltage Rating (DC): 100V; Height: 1.2mm; Max Repetitive Reverse Voltage (Vrrm): 100V; Mount: Surface Mount; Length: 2.85mm
D4 = CMP-1060-00750-1: Zener Voltage Regulator, 500 mW, 2-Pin SOD-523, Pb-Free, Tape and Reel; Manufacturer: On Semiconductor; P Max (W): 0.5; VZ Typ (V): 3.3; RoHS: Pb-Free; ComponentLink2Description: Datasheet; PackageReference: SOD-523-2-502-01; DatasheetVersion: Rev. 10; ComponentLink1Description: Manufacturer URL; PackageVersion: Rev. E, 09/2010; ComponentLink3URL: http://www.onsemi.com/pub_link/Collateral/502-01.PDF; ComponentLink2URL: http://www.onsemi.cn/pub_link/Collateral/MM5Z2V4T1-D.PDF; Mounting Technology: Surface Mount; PartNumber: MM5Z3V3T1G; Packing: Tape and Reel; PackageDescription: 2-Pin SOD, Body 1.2 x 0.8 mm; ComponentLink1URL: http://www.onsemi.com/; ComponentLink3Description: Package Specification
F?#1-F?#4 = CMP-07399-000013-1: FUSE BOARD MOUNT 2A 63VDC 1206; Voltage Rating (DC): 63V; Fuse Type: Board Mount (Cartridge Style Excluded); Approvals: UL; Mount: Surface Mount; Min Operating Temperature: -20°C; Max Operating Temperature: 105°C; Case Code (Imperial): 1206; Packaging: Cut Tape; Current Rating: 2A; RoHS Compliant: Yes; Series: SinglFuse™ SF-1206FP; Case Code (Metric): 3216; Case/Package: 1206
J1 = CMP-22265-000001-1: Right angle plug PCB w. housing
J2 = CMP-002-00087-1: Board Connector; Connector Type: BOARD CONNECTOR; RoHS Compliant: Yes
J3 = CMP-002-00090-1: Connector RJ45 Receptacle 8 Position Solder Straight Through Hole 1 Port Tray; Pins: 8; Max Operating Temperature: 70°C; Min Operating Temperature: 0°C
Q1 = CMP-2000-05968-1: N-Channel Enhancement Mode Mosfet, 50 V, 200 mA, -55 to 150 degC, 6-Pin SOT-323, RoHS, Tape and Reel; Typical Turn-Off Delay Time: 20ns; Number of Channels: 1Channel; Type: EnhancementModeFieldEffectTransistor; Brand: DiodesIncorporated; Vds - Drain-Source Breakdown Voltage: 75V; Vgs - Gate-Source Voltage: 20V; Rds On - Drain-Source Resistance: 1.4Ohms; Transistor Type: 1N-Channel; Configuration: Single; Unit Weight: 0.000212oz; Pd - Power Dissipation: 200mW; Id - Continuous Drain Current: 200mA; Forward Transconductance - Min: 0.1S; Manufacturer URL: http://www.diodes.com/; Series: BSS138; Package Description: 3-Pin Small Outline Transistor, Body 2 x 1.25 mm, Pitch 0.65 mm; Mounting Technology: SurfaceMount; Product Category: MOSFET; RoHS: True; Maximum Operating Temperature: +150C; Height: 1mm; Length: 2.2mm; Technology: Si; Width: 1.35mm; Datasheet URL: http://www.diodes.com/_files/datasheets/ds30206.pdf; Manufacturer: DiodesIncorporated; Package / Case: SOT-323-3; Typical Turn-On Delay Time: 20ns; Transistor Polarity: N-Channel; Factory Pack Quantity: 3000; Packaging: Reel; Product: MOSFETSmallSignal; Datasheet Version: Rev. 11-2, 09/2013; Package Reference: SOT323; Minimum Operating Temperature: -55C; Mounting Style: SMD/SMT; Channel Mode: Enhancement
R1-R7 = CMP-009-00002-14: Resistor
  R1 R3: Value: 100k
  R2 R4-R7: Value: 1k

## Sheet LAN8830_PINOUT.SchDoc
size C; SheetNumber: 2; SheetTotal: 12
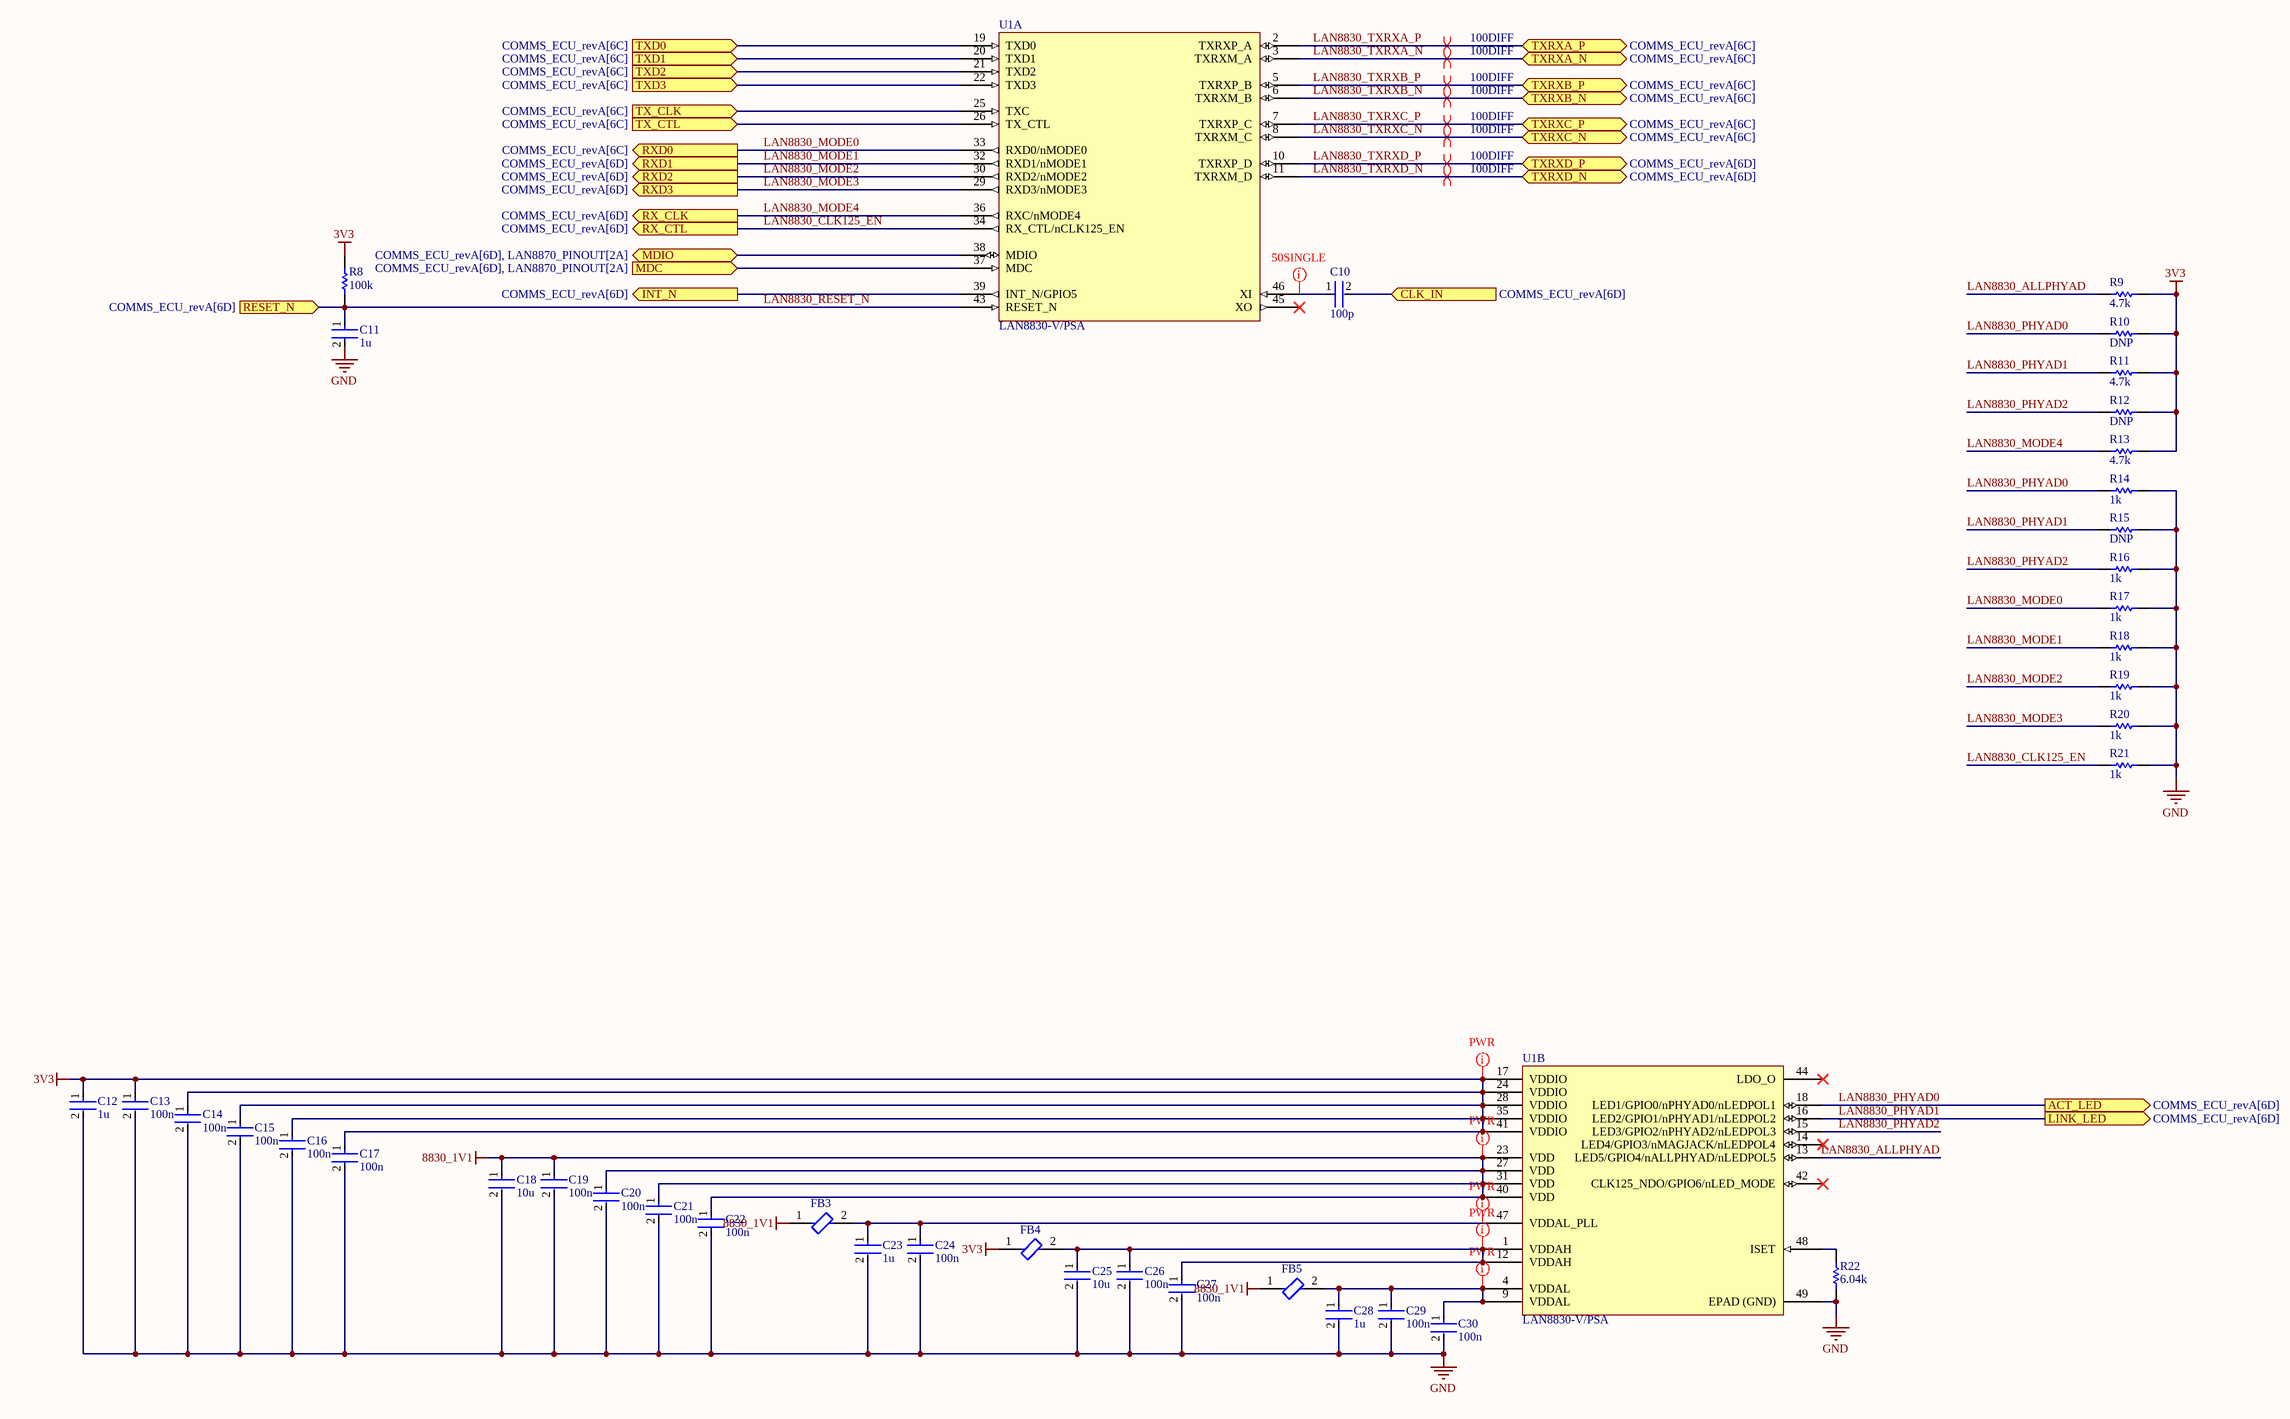
[diagram p4: LAN8830_PINOUT.SchDoc]

### Parts
C10  100p  [FP-0402-L_1_0_0_05-W_0_5-IPC_A]
C11  1u  [FP-0402-L_1_0_0_05-W_0_5-IPC_A]
C12  1u  [FP-0402-L_1_0_0_05-W_0_5-IPC_A]
C13  100n  [FP-0402-L_1_0_0_05-W_0_5-IPC_A]
C14  100n  [FP-0402-L_1_0_0_05-W_0_5-IPC_A]
C15  100n  [FP-0402-L_1_0_0_05-W_0_5-IPC_A]
C16  100n  [FP-0402-L_1_0_0_05-W_0_5-IPC_A]
C17  100n  [FP-0402-L_1_0_0_05-W_0_5-IPC_A]
C18  10u  [FP-0402-L_1_0_0_05-W_0_5-IPC_A]
C19  100n  [FP-0402-L_1_0_0_05-W_0_5-IPC_A]
C20  100n  [FP-0402-L_1_0_0_05-W_0_5-IPC_A]
C21  100n  [FP-0402-L_1_0_0_05-W_0_5-IPC_A]
C22  100n  [FP-0402-L_1_0_0_05-W_0_5-IPC_A]
C23  1u  [FP-0402-L_1_0_0_05-W_0_5-IPC_A]
C24  100n  [FP-0402-L_1_0_0_05-W_0_5-IPC_A]
C25  10u  [FP-0402-L_1_0_0_05-W_0_5-IPC_A]
C26  100n  [FP-0402-L_1_0_0_05-W_0_5-IPC_A]
C27  100n  [FP-0402-L_1_0_0_05-W_0_5-IPC_A]
C28  1u  [FP-0402-L_1_0_0_05-W_0_5-IPC_A]
C29  100n  [FP-0402-L_1_0_0_05-W_0_5-IPC_A]
C30  100n  [FP-0402-L_1_0_0_05-W_0_5-IPC_A]
FB3  BLM18KG331SH1D  [FP-BLM18-0_15-t0_8-IPC_B]  (value not drawn)
FB4  BLM18KG331SH1D  [FP-BLM18-0_15-t0_8-IPC_B]  (value not drawn)
FB5  BLM18KG331SH1D  [FP-BLM18-0_15-t0_8-IPC_B]  (value not drawn)
R8  100k  [R0603B]
R9  4.7k  [R0603B]
R10  DNP  [R0603B]
R11  4.7k  [R0603B]
R12  DNP  [R0603B]
R13  4.7k  [R0603B]
R14  1k  [R0603B]
R15  DNP  [R0603B]
R16  1k  [R0603B]
R17  1k  [R0603B]
R18  1k  [R0603B]
R19  1k  [R0603B]
R20  1k  [R0603B]
R21  1k  [R0603B]
R22  6.04k  [R0603B]
U1  LAN8830-V/PSA  [QFN50P700X700X100_HS-49N]  (parts A,B of 2)

### Ports
ACT_LED (out, see COMMS_ECU_revA[6D]), CLK_IN (in, see COMMS_ECU_revA[6D]), INT_N (out, see COMMS_ECU_revA[6D]), LINK_LED (out, see COMMS_ECU_revA[6D]), MDC (in, see COMMS_ECU_revA[6D], LAN8870_PINOUT[2A]), MDIO (bidir, see COMMS_ECU_revA[6D], LAN8870_PINOUT[2A]), RESET_N (in, see COMMS_ECU_revA[6D]), RX_CLK (out, see COMMS_ECU_revA[6D]), RX_CTL (out, see COMMS_ECU_revA[6D]), RXD0 (out, see COMMS_ECU_revA[6C]), RXD1 (out, see COMMS_ECU_revA[6D]), RXD2 (out, see COMMS_ECU_revA[6D]), RXD3 (out, see COMMS_ECU_revA[6D]), TX_CLK (in, see COMMS_ECU_revA[6C]), TX_CTL (in, see COMMS_ECU_revA[6C]), TXD0 (in, see COMMS_ECU_revA[6C]), TXD1 (in, see COMMS_ECU_revA[6C]), TXD2 (in, see COMMS_ECU_revA[6C]), TXD3 (in, see COMMS_ECU_revA[6C]), TXRXA_N (bidir, see COMMS_ECU_revA[6C]), TXRXA_P (bidir, see COMMS_ECU_revA[6C]), TXRXB_N (bidir, see COMMS_ECU_revA[6C]), TXRXB_P (bidir, see COMMS_ECU_revA[6C]), TXRXC_N (bidir, see COMMS_ECU_revA[6C]), TXRXC_P (bidir, see COMMS_ECU_revA[6C]), TXRXD_N (bidir, see COMMS_ECU_revA[6D]), TXRXD_P (bidir, see COMMS_ECU_revA[6D])

### Nets
3V3: C12.1 C13.1 C14.1 C15.1 C16.1 C17.1 FB4.1 R8.1 R9.1 R10.2 R11.1 R12.2 R13.1 U1.17(VDDIO) U1.24(VDDIO) U1.28(VDDIO) U1.35(VDDIO) U1.41(VDDIO)
8830_1V1: C18.1 C19.1 C20.1 C21.1 C22.1 FB3.1 FB5.1 U1.23(VDD) U1.27(VDD) U1.31(VDD) U1.40(VDD)
GND: C11.2 C12.2 C13.2 C14.2 C15.2 C16.2 C17.2 C18.2 C19.2 C20.2 C21.2 C22.2 C23.2 C24.2 C25.2 C26.2 C27.2 C28.2 C29.2 C30.2 R14.1 R15.2 R16.1 R17.1 R18.1 R19.1 R20.1 R21.1 R22.2 U1.49(EPAD_(GND))
3V3_LAN8830_CLK: C10.2 ; port CLK_IN
3V3_LAN8830_nINT: U1.39(INT_N/GPIO5) ; port INT_N
3V3_MDC: U1.37(MDC) ; port MDC
3V3_MDIO: U1.38(MDIO) ; port MDIO
LAN8830_ALLPHYAD: R9.2 U1.13(LED5/GPIO4/nALLPHYAD/nLEDPOL5)
LAN8830_CLK125_EN: R21.2 U1.34(RX_CTL/nCLK125_EN) ; port RX_CTL
LAN8830_MODE0: R17.2 U1.33(RXD0/nMODE0) ; port RXD0
LAN8830_MODE1: R18.2 U1.32(RXD1/nMODE1) ; port RXD1
LAN8830_MODE2: R19.2 U1.30(RXD2/nMODE2) ; port RXD2
LAN8830_MODE3: R20.2 U1.29(RXD3/nMODE3) ; port RXD3
LAN8830_MODE4: R13.2 U1.36(RXC/nMODE4) ; port RX_CLK
LAN8830_PHYAD0: R10.1 R14.2 U1.18(LED1/GPIO0/nPHYAD0/nLEDPOL1) ; port ACT_LED
LAN8830_PHYAD1: R11.2 R15.1 U1.16(LED2/GPIO1/nPHYAD1/nLEDPOL2) ; port LINK_LED
LAN8830_PHYAD2: R12.1 R16.2 U1.15(LED3/GPIO2/nPHYAD2/nLEDPOL3)
LAN8830_RESET_N: C11.1 R8.2 U1.43(RESET_N) ; port RESET_N  [project net 3V3_LAN8830_nRST]
LAN8830_TXRXA_N: U1.3(TXRXM_A) ; port TXRXA_N
LAN8830_TXRXA_P: U1.2(TXRXP_A) ; port TXRXA_P
LAN8830_TXRXB_N: U1.6(TXRXM_B) ; port TXRXB_N
LAN8830_TXRXB_P: U1.5(TXRXP_B) ; port TXRXB_P
LAN8830_TXRXC_N: U1.8(TXRXM_C) ; port TXRXC_N
LAN8830_TXRXC_P: U1.7(TXRXP_C) ; port TXRXC_P
LAN8830_TXRXD_N: U1.11(TXRXM_D) ; port TXRXD_N
LAN8830_TXRXD_P: U1.10(TXRXP_D) ; port TXRXD_P
NetC10_1: C10.1 U1.46(XI)
NetC23_1: C23.1 C24.1 FB3.2 U1.47(VDDAL_PLL)
NetC25_1: C25.1 C26.1 C27.1 FB4.2 U1.1(VDDAH) U1.12(VDDAH)
NetC28_1: C28.1 C29.1 C30.1 FB5.2 U1.4(VDDAL) U1.9(VDDAL)
NetR22_1: R22.1 U1.48(ISET)
NetU1_19: U1.19(TXD0) ; port TXD0
NetU1_20: U1.20(TXD1) ; port TXD1
NetU1_21: U1.21(TXD2) ; port TXD2
NetU1_22: U1.22(TXD3) ; port TXD3
NetU1_25: U1.25(TXC) ; port TX_CLK
NetU1_26: U1.26(TX_CTL) ; port TX_CTL

Not connected (* = marked no-connect by the designer): U1 14(LED4/GPIO3/nMAGJACK/nLEDPOL4)* 42(CLK125_NDO/GPIO6/nLED_MODE)* 44(LDO_O)* 45(XO)*

### Layout directives
differential pair; differential pair class 100DIFF; differential pair class 1000BASET: LAN8830_TXRXA_N, LAN8830_TXRXA_P, LAN8830_TXRXB_N, LAN8830_TXRXB_P, LAN8830_TXRXC_N, LAN8830_TXRXC_P, LAN8830_TXRXD_N, LAN8830_TXRXD_P
net class PWR: 3V3, 8830_1V1, NetC23_1, NetC25_1, NetC28_1
net class 50SINGLE: NetC10_1

### Library data of the parts
C10-C30 = CMP-001-00058-1: as C1 on sheet COMMS_ECU_revA; Min Operating Temperature: -55°C; Mounting Technology: Surface Mount; Pins: 2; Case/Package: 0402; RoHS Compliant: Yes; Max Operating Temperature: 85°C
FB3-FB5 = CMP-06046-002069-1: Chip Ferrite Bead, 0603, 330Ω @ 100MHz, 0.08Ω, 25%, 1.7A; Number of Lines: 1; DC Resistance (DCR): 80mR; Packaging: Tape and Reel; Case/Package: 0603; Height: 0.037inch; Case Code (Metric): 1608; Length: 0.063inch; Package Quantity: 4000; Max Operating Temperature: 125°C; Case Code (Imperial): 0603; RoHS Compliant: Yes; Width: 0.032inch; Mount: Surface Mount; Min Operating Temperature: -55°C; Ratings: AEC-Q200; Max Current Rating: 1.7A
R8-R22 = CMP-009-00002-14: Resistor
  R8: Value: 100k
  R9 R11 R13: Value: 4.7k
  R10 R12 R15: Value: DNP
  R14 R16-R21: Value: 1k
  R22: Value: 6.04k
U1 = CMP-015-00022-5: LAN8830 Series RGMII Interface Gigabit Ethernet Transceiver - VQFN-48; Case/Package: VQFN; Pins: 48